# Altium schematic sheet bus.SchDoc
size A4
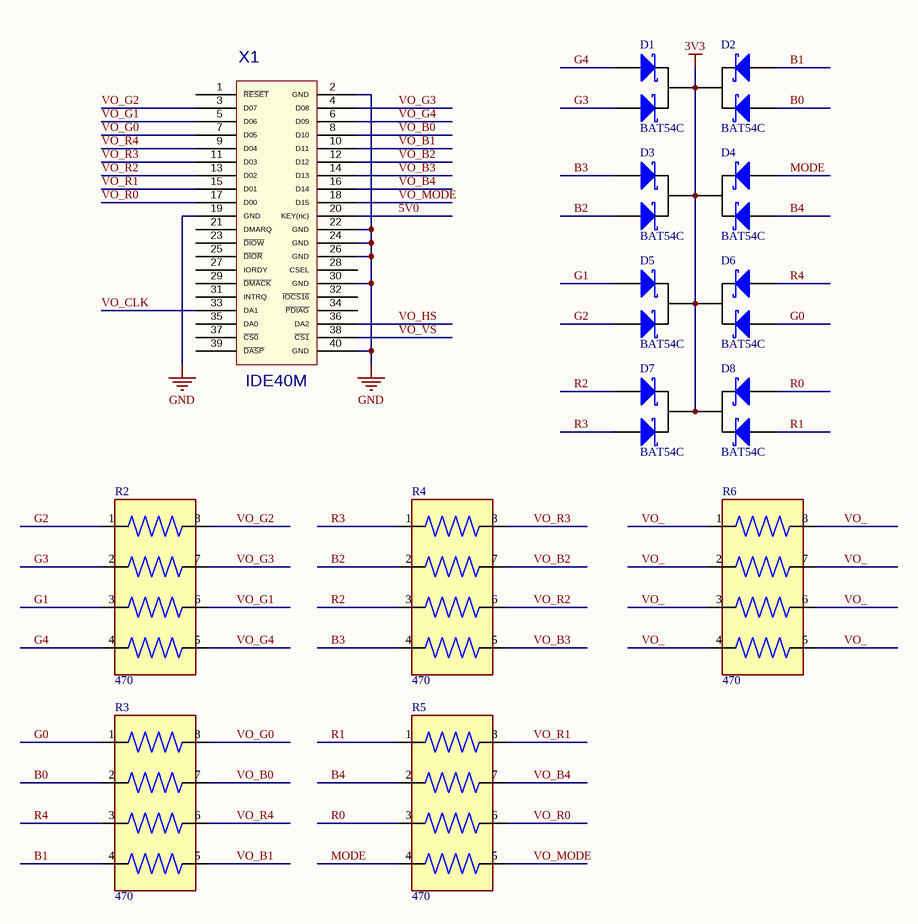
[diagram p0: bus.SchDoc]

## Parts
D1  BAT54C  [SOT-23]
D2  BAT54C  [SOT-23]
D3  BAT54C  [SOT-23]
D4  BAT54C  [SOT-23]
D5  BAT54C  [SOT-23]
D6  BAT54C  [SOT-23]
D7  BAT54C  [SOT-23]
D8  BAT54C  [SOT-23]
R2  470  [RESCAV50P200X100X55-8N]
R3  470  [RESCAV50P200X100X55-8N]
R4  470  [RESCAV50P200X100X55-8N]
R5  470  [RESCAV50P200X100X55-8N]
R6  470  [RESCAV50P200X100X55-8N]
X1  IDE40M  [IDE40M]

## Nets
3V3: D1.3(C) D2.3(C) D3.3(C) D4.3(C) D5.3(C) D6.3(C) D7.3(C) D8.3(C)
GND: X1.2(GND) X1.19(GND) X1.22(GND) X1.24(GND) X1.26(GND) X1.30(GND) X1.40(GND)
5V0: X1.20(KEY(nc))
B0: D2.2(A) R3.2
B1: D2.1(A) R3.4
B2: D3.2(A) R4.2
B3: D3.1(A) R4.4
B4: D4.2(A) R5.2
G0: D6.2(A) R3.1
G1: D5.1(A) R2.3
G2: D5.2(A) R2.1
G3: D1.2(A) R2.2
G4: D1.1(A) R2.4
MODE: D4.1(A) R5.4
R0: D8.1(A) R5.3
R1: D8.2(A) R5.1
R2: D7.1(A) R4.3
R3: D7.2(A) R4.1
R4: D6.1(A) R3.3
VO_: R6.1 R6.2 R6.3 R6.4 R6.5 R6.6 R6.7 R6.8
VO_B0: R3.7 X1.8(D10)
VO_B1: R3.5 X1.10(D11)
VO_B2: R4.7 X1.12(D12)
VO_B3: R4.5 X1.14(D13)
VO_B4: R5.7 X1.16(D14)
VO_CLK: X1.33(DA1)
VO_G0: R3.8 X1.7(D05)
VO_G1: R2.6 X1.5(D06)
VO_G2: R2.8 X1.3(D07)
VO_G3: R2.7 X1.4(D08)
VO_G4: R2.5 X1.6(D09)
VO_HS: X1.36(DA2)
VO_MODE: R5.5 X1.18(D15)
VO_R0: R5.6 X1.17(D00)
VO_R1: R5.8 X1.15(D01)
VO_R2: R4.6 X1.13(D02)
VO_R3: R4.8 X1.11(D03)
VO_R4: R3.6 X1.9(D04)
VO_VS: X1.38(~{CS1})

Not connected (* = marked no-connect by the designer): X1 1(~{RESET}) 21(DMARQ) 23(~{DIOW}) 25(~{DIOR}) 27(IORDY) 28(CSEL) 29(~{DMACK}) 31(INTRQ) 32(~{IOCS16}) 34(~{PDIAG}) 35(DA0) 37(~{CS0}) 39(~{DASP})

## Library data of the parts
R2-R6 = CAT10-***4LF: *** Ohm Â±5% 62.5mW Power Per Element Isolated Resistor Network/Array Â±250ppm/Â°C 0804, Concave, Long Side Terminals; MP: CAT10-101J4LF; Package: None; Price: None; Value: 470; Availability: Unavailable
X1 = IDE40M: Value: *